# EasyEDA schematic Ground_Station.json
TITLE: CANSAT; REV: 1.0; Date: 24-06-2021; Sheet: 1/1; Drawn By: Albin Joseph C.R; Company: SSERD
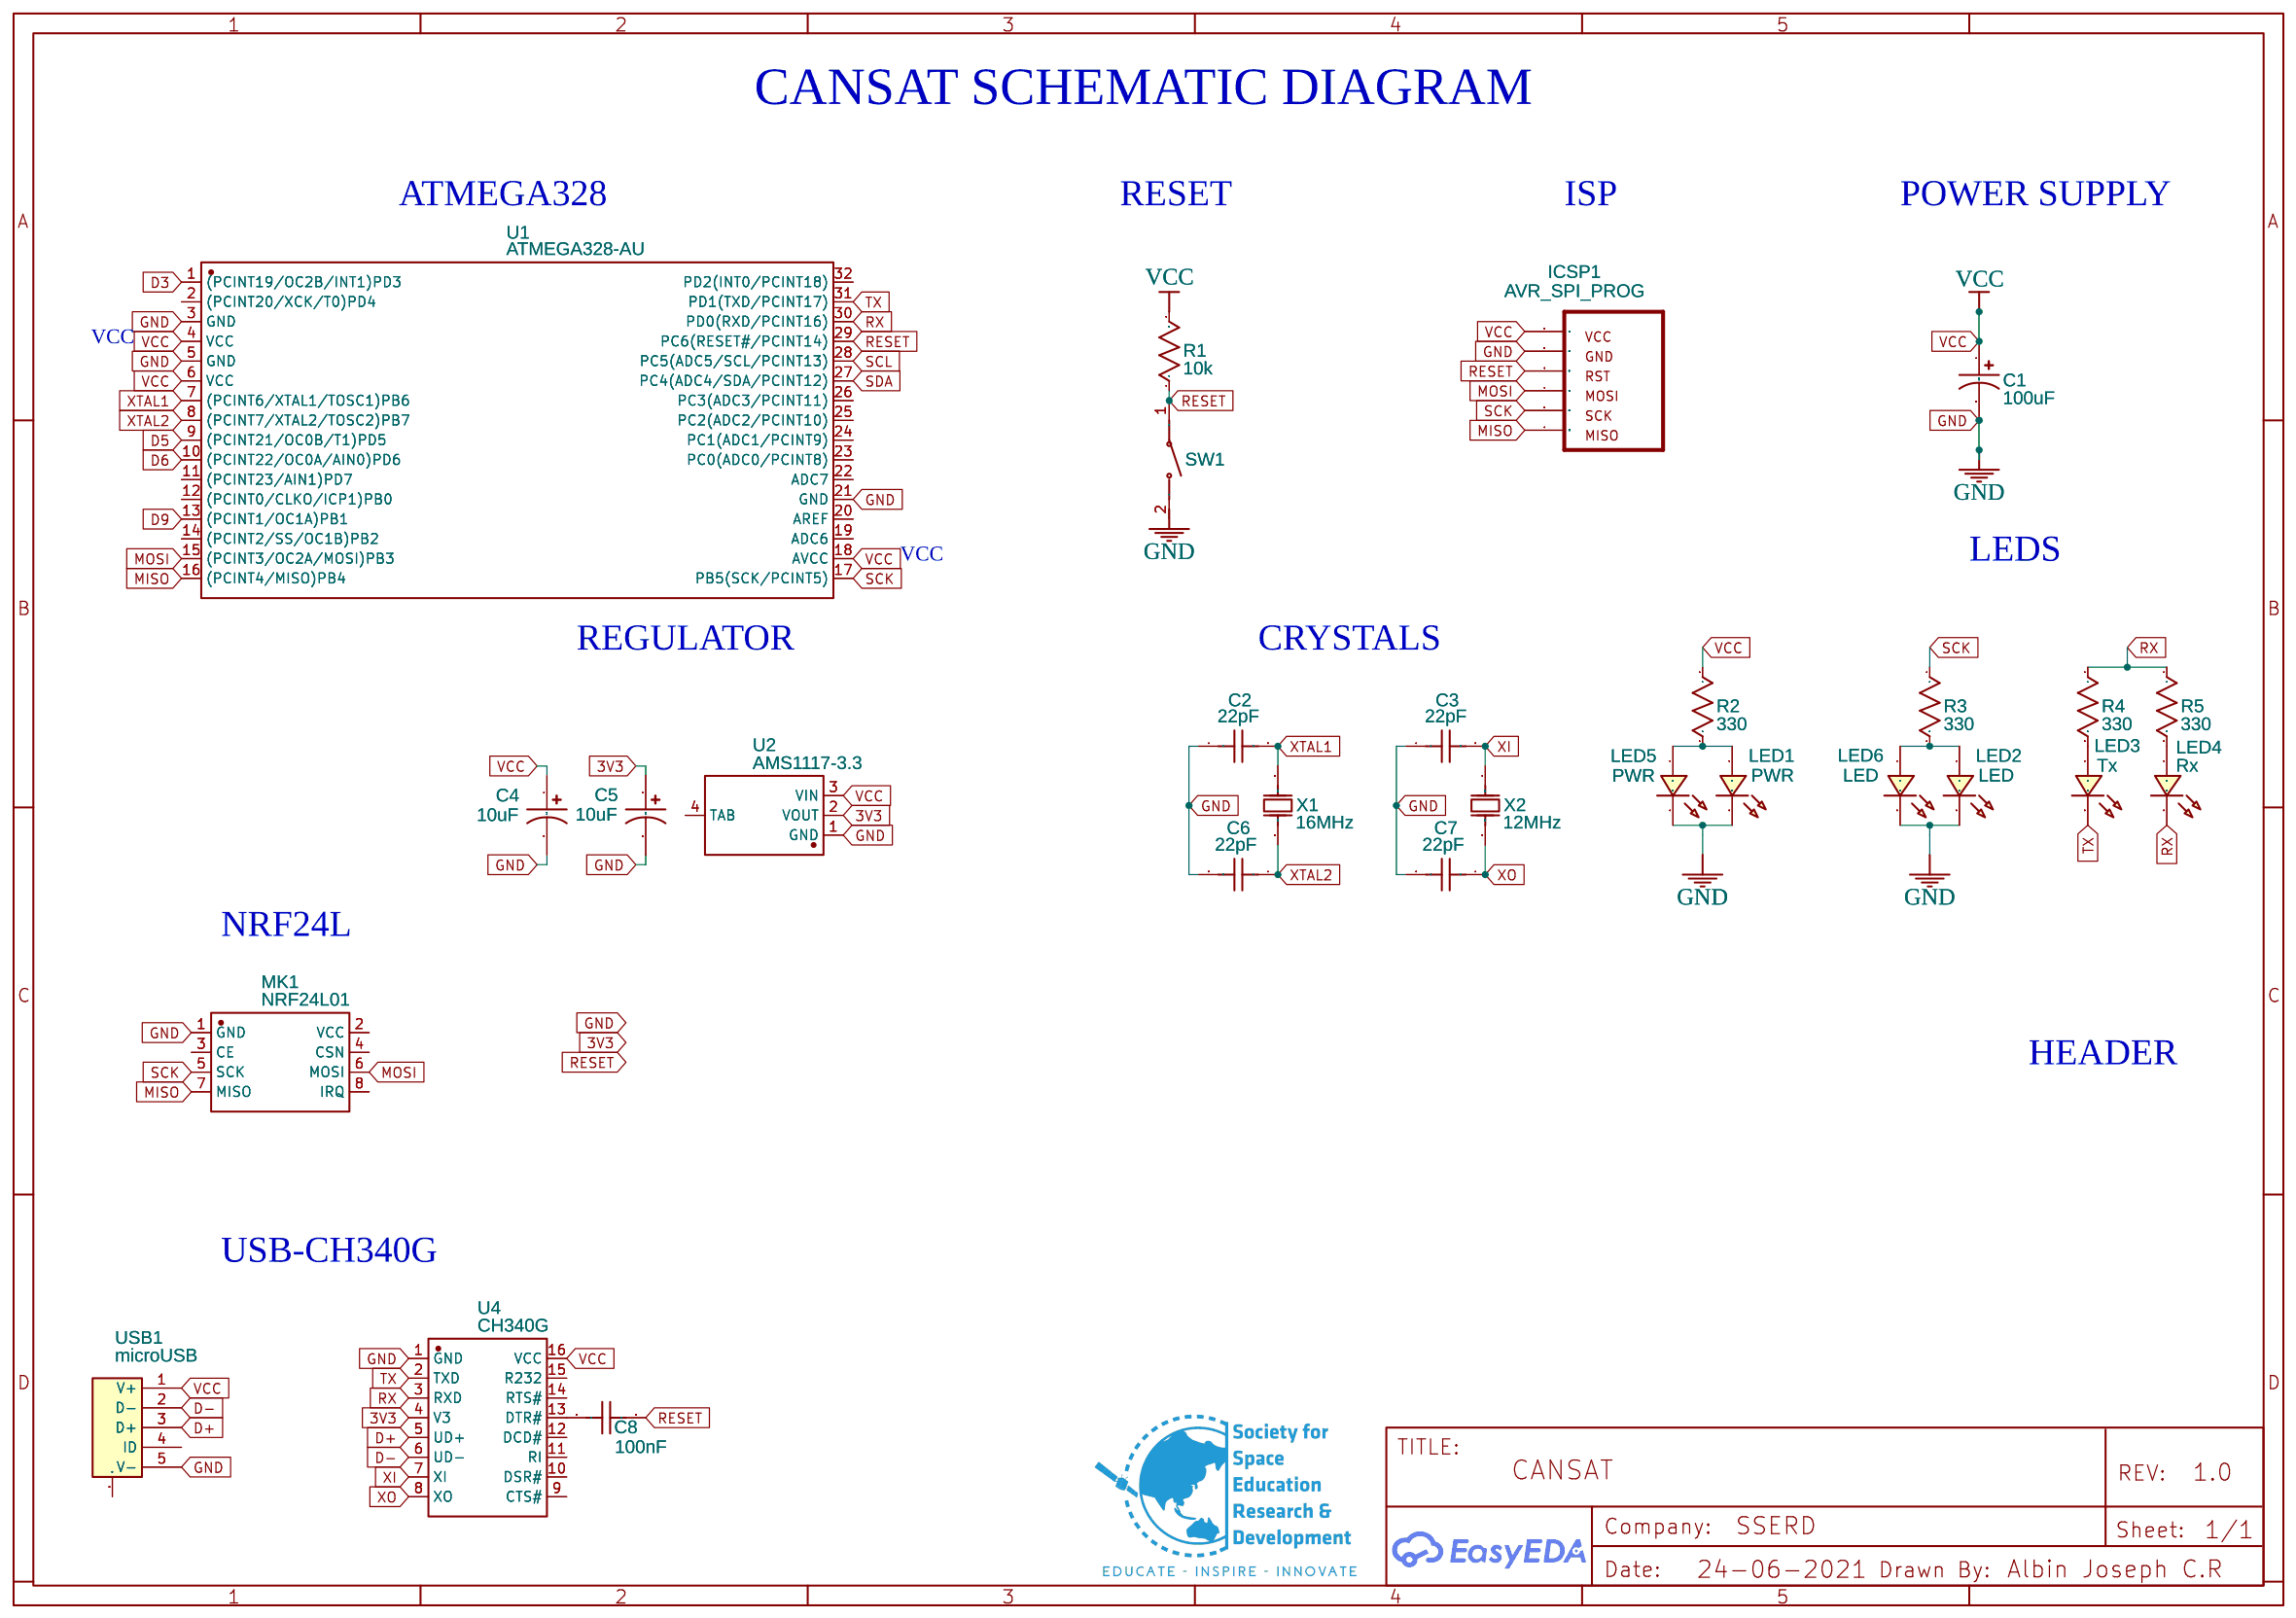
[diagram p0: schematic sheet]

## Parts
C1  100uF  [C1206]
C2  22pF  [C1206]
C3  22pF  [C1206]
C4  10uF  [C1206]
C5  10uF  [C1206]
C6  22pF  [C1206]
C7  22pF  [C1206]
C8  100nF  [C1206]
ICSP1  AVR_SPI_PROG  [PA_M3X2]
LED1  PWR  [LED1206-RD]
LED2  LED  [LED1206-RD]
LED3  Tx  [LED1206-RD]
LED4  Rx  [LED1206-RD]
LED5  PWR  [LED-TH_BD3.0_GREEN]
LED6  LED  [LED-TH_BD3.0_GREEN]
MK1  NRF24L01  [WIRELM-SMD_NRF24L01]
R1  10k  [R1206]
R2  330  [R1206]
R3  330  [R1206]
R4  330  [R1206]
R5  330  [R1206]
SW1  SWITCH,3*6*2.5  [SW-TH_L6.2-W3.6-LS8.0]
U1  ATMEGA328-AU  [TQFP-32_L7.0-W7.0-P0.80-LS9.0-BL]
U2  AMS1117-3.3  [SOT-223-3_L6.5-W3.4-P2.30-LS7.0-BR]
U4  CH340G  [SOIC-16_L9.9-W3.9-P1.27-LS6.0-BR]
USB1  microUSB  [MICRO-USB-SMD_5P-P0.65-H-F_C10418]
X1  16MHz  [HC-49S_L11.0-W4.4-P4.88]
X2  12MHz  [HC-49S_L11.0-W4.4-P4.88]

## Library data of the parts
C1 C4 C5 = CE_TH_D4.0×F1.5_US: Contributor: LCEDA_Lib
C2 C3 C6-C8 = CC1H0R5CA1BDCH4B10MF: Supplier: LCSC; Supplier Part: C254078; Manufacturer: Dersonic; Contributor: LCSC; JLCPCB Part Class: Extended Part
ICSP1 = PA_AVR_SPI_PROGRAMMER_ARDUINO: PatternAgents Atmel AVR SPI Programmer Pattern; Contributor: PatternAgents
LED1 LED2 = LED-0805_G: Manufacturer: 国星光电; Manufacturer Part: NCD0805G1; Supplier Part: C84260; Contributor: LCEDA_Lib
LED3 LED4 = LED-0805_B: Manufacturer: 方舟 ARKLED; Manufacturer Part: D-B080508B1-KS2; Supplier Part: C108412; Contributor: LCEDA_Lib
LED5 LED6 = LED-TH-3mm_G: Manufacturer: EVERLIGHT(台湾亿光); Manufacturer Part: 204-10SYGD/S530-E3; Supplier Part: C85161; Contributor: LCEDA_Lib
MK1 = NRF24L01: Supplier: LCSC; Manufacturer: Ai-Thinker; Manufacturer Part: NRF24L01+功率加强版绑定2.4Gwireless module; Supplier Part: C90751; JLCPCB Part Class: Extended Part
R1-R5 = R_AXIAL-0.4_US: Contributor: LCEDA_Lib
SW1 = SWITCH,3*6*5PLASTIC HEAD WHITE,260G, 0.25MM,SMD: Supplier: LCSC; Manufacturer: BBJ; Manufacturer Part: Switch,3*6*5Plastic head white,260G, 0.25mm,SMD; Contributor: LCSC; Supplier Part: C71855
U1 = ATMEGA328-AU: Supplier: LCSC; Supplier Part: C618731; Manufacturer: MICROCHIP(美国微芯); Contributor: LCSC; JLCPCB Part Class: Extended Part
U2 = AMS1117-1.8_C498120: Supplier: LCSC; Supplier Part: C498120; Manufacturer: HGC(Huaguan Semicon); Manufacturer Part: AMS1117-1.8; Contributor: LCSC; JLCPCB Part Class: Extended Part
U4 = CH340G: Supplier: LCSC; Manufacturer: WCH; Supplier Part: C14267; JLCPCB Part Class: Basic Part
USB1 = micro USBFemale: Supplier: LCSC; Manufacturer: ValuePro; Supplier Part: C10418; JLCPCB Part Class: Extended Part
X1 X2 = 9AC10000202060: Supplier: LCSC; Supplier Part: C1508959; Manufacturer: JGHC(晶光华); Contributor: LCSC; JLCPCB Part Class: Extended Part

## Nets
3V3: C5.1 U2.2(VOUT) U4.4(V3)
GND: C1.2 C2.1 C3.1 C4.2 C5.2 C6.2 C7.2 ICSP1.6(GND) LED1.2 LED2.2 LED5.2 LED6.2 MK1.1(GND) SW1.2 U1.3(GND) U1.5(GND) U1.21(GND) U2.1(GND) U4.1(GND) USB1.5(V-)
VCC: C1.1 C4.1 ICSP1.2(VCC) R1.2 R2.1 U1.4(VCC) U1.6(VCC) U1.18(AVCC) U2.3(VIN) U4.16(VCC) USB1.1(V+)
D3: U1.1((PCINT19/OC2B/INT1)PD3)
D5: U1.9((PCINT21/OC0B/T1)PD5)
D6: U1.10((PCINT22/OC0A/AIN0)PD6)
D9: U1.13((PCINT1/OC1A)PB1)
D+: U4.5(UD+) USB1.3(D+)
D-: U4.6(UD-) USB1.2(D-)
MISO: ICSP1.1(MISO) MK1.7(MISO) U1.16((PCINT4/MISO)PB4)
MOSI: ICSP1.4(MOSI) MK1.6(MOSI) U1.15((PCINT3/OC2A/MOSI)PB3)
RESET: C8.2 ICSP1.5(RST) R1.1 SW1.1 U1.29(PC6(RESET#/PCINT14))
RX: LED4.2 R4.1 R5.1 U1.30(PD0(RXD/PCINT16)) U4.3(RXD)
SCK: ICSP1.3(SCK) MK1.5(SCK) R3.1 U1.17(PB5(SCK/PCINT5))
SCL: U1.28(PC5(ADC5/SCL/PCINT13))
SDA: U1.27(PC4(ADC4/SDA/PCINT12))
TX: LED3.2 U1.31(PD1(TXD/PCINT17)) U4.2(TXD)
XI: C3.2 U4.7(XI) X2.1(OSC1)
XO: C7.1 U4.8(XO) X2.2(OSC2)
XTAL1: C2.2 U1.7((PCINT6/XTAL1/TOSC1)PB6) X1.1(OSC1)
XTAL2: C6.1 U1.8((PCINT7/XTAL2/TOSC2)PB7) X1.2(OSC2)
Net-(C8-1): C8.1 U4.13(DTR#)
Net-(LED1-1): LED1.1 LED5.1 R2.2
Net-(LED2-1): LED2.1 LED6.1 R3.2
Net-(LED3-1): LED3.1 R4.2
Net-(LED4-1): LED4.1 R5.2

Not connected (* = marked no-connect by the designer): MK1 2(VCC) 3(CE) 4(CSN) 8(IRQ); U1 2((PCINT20/XCK/T0)PD4) 11((PCINT23/AIN1)PD7) 12((PCINT0/CLKO/ICP1)PB0) 14((PCINT2/SS/OC1B)PB2) 19(ADC6) 20(AREF) 22(ADC7) 23(PC0(ADC0/PCINT8)) 24(PC1(ADC1/PCINT9)) 25(PC2(ADC2/PCINT10)) 26(PC3(ADC3/PCINT11)) 32(PD2(INT0/PCINT18)); U2 4(TAB); U4 9(CTS#) 10(DSR#) 11(RI) 12(DCD#) 14(RTS#) 15(R232); USB1 0(MTN) 4(ID)

## Notes on the sheet
- CANSAT SCHEMATIC DIAGRAM
- ATMEGA328
- RESET
- ISP
- POWER SUPPLY
- VCC
- VCC
- LEDS
- REGULATOR
- CRYSTALS
- NRF24L
- HEADER
- USB-CH340G
